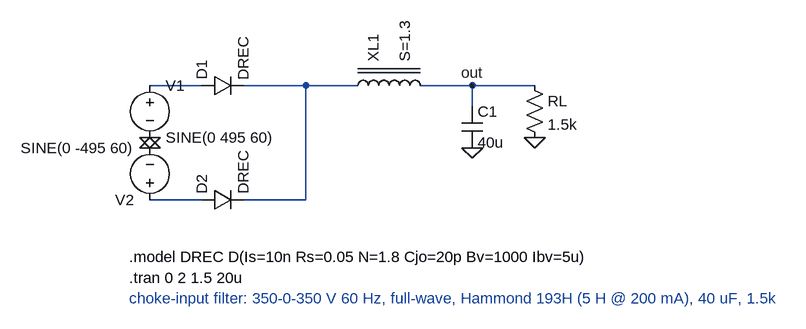
[diagram p0: schematic demo_choke.asc]
demo_choke.asc, the LTspice schematic file:
Version 4
SHEET 1 1000 460
WIRE 96 112 176 112
WIRE 240 112 336 112
WIRE 96 288 176 288
WIRE 240 288 336 288
WIRE 336 112 336 288
WIRE 336 112 416 112
WIRE 512 112 592 112
WIRE 592 112 592 144
WIRE 592 112 688 112
FLAG 96 192 0
FLAG 96 208 0
FLAG 592 208 0
FLAG 688 192 0
FLAG 592 112 out
SYMBOL voltage 96 96 R0
SYMATTR InstName V1
SYMATTR Value SINE(0 495 60)
SYMBOL voltage 96 304 R180
SYMATTR InstName V2
SYMATTR Value SINE(0 -495 60)
SYMBOL diode 176 128 R270
SYMATTR InstName D1
SYMATTR Value DREC
SYMBOL diode 176 304 R270
SYMATTR InstName D2
SYMATTR Value DREC
SYMBOL CH_193H 400 128 R270
SYMATTR InstName XL1
SYMATTR Value S=1.3
SYMBOL cap 576 144 R0
SYMATTR InstName C1
SYMATTR Value 40u
SYMBOL res 672 96 R0
SYMATTR InstName RL
SYMATTR Value 1.5k
TEXT 64 376 Left 2 !.model DREC D(Is=10n Rs=0.05 N=1.8 Cjo=20p Bv=1000 Ibv=5u)
TEXT 64 408 Left 2 !.tran 0 2 1.5 20u
TEXT 64 440 Left 2 ;choke-input filter: 350-0-350 V 60 Hz, full-wave, Hammond 193H (5 H @ 200 mA), 40 uF, 1.5k

The netlist it stands for:
* demo_choke.asc
V1 N001 0 SINE(0 495 60)
V2 N003 0 SINE(0 -495 60)
D1 N001 N002 DREC
D2 N003 N002 DREC
XXL1 N002 out CH_193H S=1.3  ; pins A B
C1 out 0 40u
RL out 0 1.5k
.model D D
.lib standard.dio
.model DREC D(Is=10n Rs=0.05 N=1.8 Cjo=20p Bv=1000 Ibv=5u)
.tran 0 2 1.5 20u
* choke-input filter: 350-0-350 V 60 Hz, full-wave, Hammond 193H (5 H @ 200 mA), 40 uF, 1.5k
.lib choke.sub
.backanno
.end